# EAGLE design HallSenseV2 (EAGLE 8.6.0)
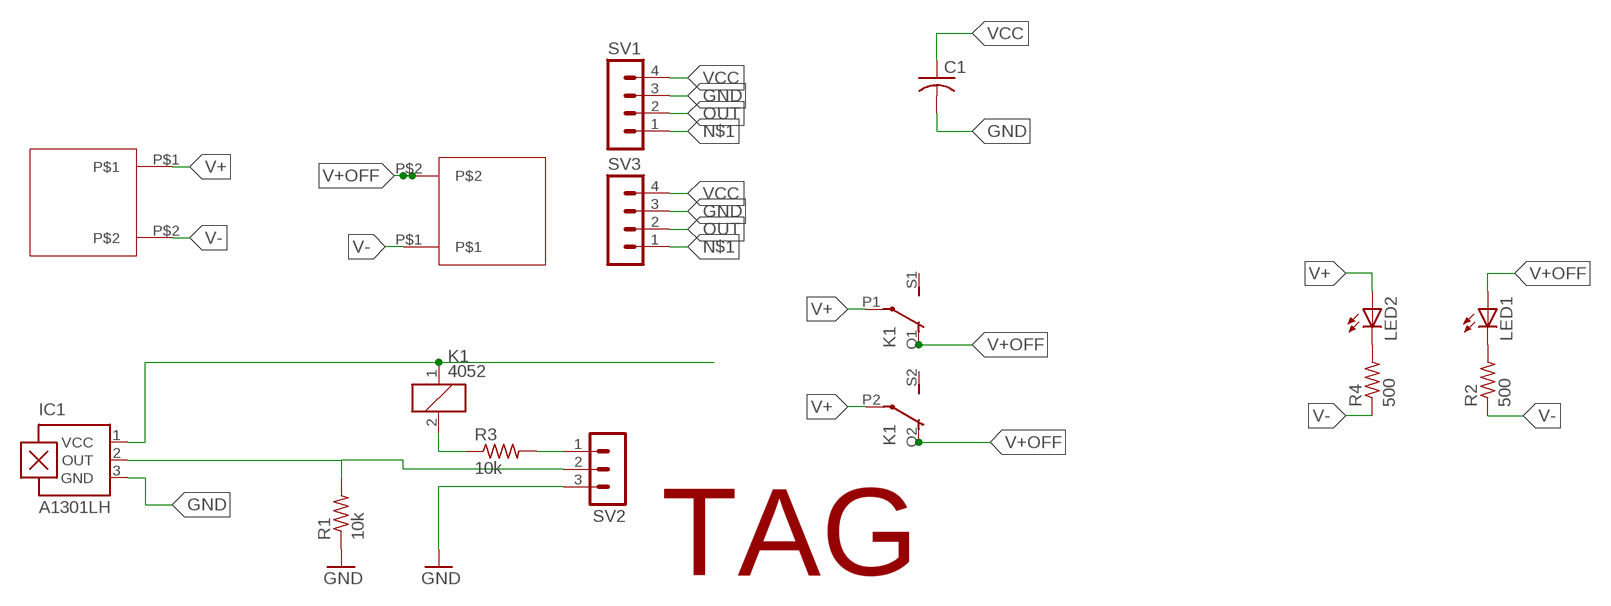
[diagram p0: schematic, sheet 1]

## Parts
C1  C-USC0805K  [C0805K]
IC1  A1301LH  [SOT23-W]
K1  4052  [F4052]
LED1  LED5MM  [LED5MM]
LED2  LED5MM  [LED5MM]
R1  10k  R-US_R0805  [R0805]
R2  500  R-US_0207/10  [0207/10]
R3  10k  R-US_R0805  [R0805]
R4  500  R-US_0207/10  [0207/10]
SV1  MA04-1  [MA04-1]
SV2  MA03-1  [MA03-1]
SV3  MA04-1  [MA04-1]
U$1  TERM_POWER  [TERM_BLOCK_POWER]
U$2  TERM_POWER  [TERM_BLOCK_POWER]
U$3  TAG  [TAG]

## Nets
GND: C1.2 IC1.3(GND) R1.1 SV1.3 SV2.3 SV3.3
N$1: K1.2 R3.1 SV1.1 SV3.1
N$2: LED2.K(C) R4.2
N$3: LED1.K(C) R2.2
N$4: R3.2 SV2.1
OUT: IC1.2(OUT) R1.2 SV1.2 SV2.2 SV3.2
V+: K1.P1(2:P) K1.P2(3:P) LED2.A U$1.P$1
V+OFF: K1.O1(2:O) K1.O2(3:O) LED1.A U$2.P$2
V-: R2.1 R4.1 U$1.P$2 U$2.P$1
VCC: C1.1 IC1.1(VCC) K1.1 SV1.4 SV3.4
Unconnected: K1.S1(2:S) K1.S2(3:S)

## Library data of the parts
C1 = rcl:C-US: CAPACITOR, American symbol; SPICEPREFIX: C
IC1 = allegro:A13*?: Linear Hall Effect Sensor ICs Continuous-Time Ratiometric High-Temperature Operation Programmable Linear with Analog Output A1302 -Replacement- UGN3503 Source: http://www.allegromicro.com/en/Products/Part_Numbers/1301/1301.pdf http://www.allegromicro.com/en/Products/Part_Numbers/1321/1321.pdf http://www.allegromicro.com/en/Products/Part_Numbers/1381/1381.pdf; MF: ALLEGRO MICROSYSTEMS, INC.; MPN: A1301ELHLT-T; OC_FARNELL: 1198084; OC_NEWARK: 31K6634
K1 = relay:4052: RELAY 2 x switch, Finder; OC_FARNELL: unknown; OC_NEWARK: unknown; SPICEPREFIX: J
LED1 LED2 = led:LED: LED OSRAM: - CHIPLED LG R971, LG N971, LY N971, LG Q971, LY Q971, LO R971, LY R971 LH N974, LH R974 LS Q976, LO Q976, LY Q976 LO Q996 - Hyper CHIPLED LW Q18S LB Q993, LB Q99A, LB R99A - SideLED LS A670, LO A670, LY A670, LG A670, LP A670 LB A673, LV A673, LT A673, LW A673 LH A674 LY A675 LS A676, LA A676, LO A676, LY A676, LW A676 LS A679, LY A679, LG A679 - Hyper Micro SIDELED® LS Y876, LA Y876, LO Y876, LY Y876 LT Y87S - SmartLED LW L88C, LW L88S LB L89C, LB L89S, LG L890 LS L89K, LO L89K, LY L89K LS L896, LA L896, LO L896, LY L896 - TOPLED LS T670, LO T670, LY T670, LG T670, LP T670 LSG T670, LSP T670, LSY T670, LOP T670, LYG T670 LG T671, LOG T671, LSG T671 LB T673, LV T673, LT T673, LW T673 LH T674 LS T676, LA T676, LO T676, LY T676, LB T676, LH T676, LSB T676, LW T676 LB T67C, LV T67C, LT T67C, LS T67K, LO T67K, LY T67K, LW E67C LS E67B, LA E67B, LO E67B, LY E67B, LB E67C, LV E67C, LT E67C LW T67C LS T679, LY T679, LG T679 LS T770, LO T770, LY T770, LG T770, LP T770 LB T773, LV T773, LT T773, LW T773 LH T774 LS E675, LA E675, LY E675, LS T675 LS T776, LA T776, LO T776, LY T776, LB T776 LHGB T686 LT T68C, LB T68C - Hyper Mini TOPLED® LB M676 - Mini TOPLED Santana® LG M470 LS M47K, LO M47K, LY M47K Source: http://www.osram.convergy.de LUXEON: - LUMILED® LXK2-PW12-R00, LXK2-PW12-S00, LXK2-PW14-U00, LXK2-PW14-V00 LXK2-PM12-R00, LXK2-PM12-S00, LXK2-PM14-U00 LXK2-PE12-Q00, LXK2-PE12-R00, LXK2-PE12-S00, LXK2-PE14-T00, LXK2-PE14-U00 LXK2-PB12-K00, LXK2-PB12-L00, LXK2-PB12-M00, LXK2-PB14-N00, LXK2-PB14-P00, LXK2-PB14-Q00 LXK2-PR12-L00, LXK2-PR12-M00, LXK2-PR14-Q00, LXK2-PR14-R00 LXK2-PD12-Q00, LXK2-PD12-R00, LXK2-PD12-S00 LXK2-PH12-R00, LXK2-PH12-S00 LXK2-PL12-P00, LXK2-PL12-Q00, LXK2-PL12-R00 Source: www.luxeon.com KINGBRIGHT: KA-3528ASYC Source: www.kingbright.com
R1 R3 = resistor:R-US_: RESISTOR, American symbol
R2 R4 = rcl:R-US_: RESISTOR, American symbol; SPICEPREFIX: R
SV1 SV3 = con-lstb:MA04-1: PIN HEADER; OC_FARNELL: unknown; OC_NEWARK: unknown
SV2 = con-lstb:MA03-1: PIN HEADER; OC_FARNELL: unknown; OC_NEWARK: unknown
U$1 U$2 = TERM_POWER:TERM_POWER
U$3 = TAG:TAG

## Board
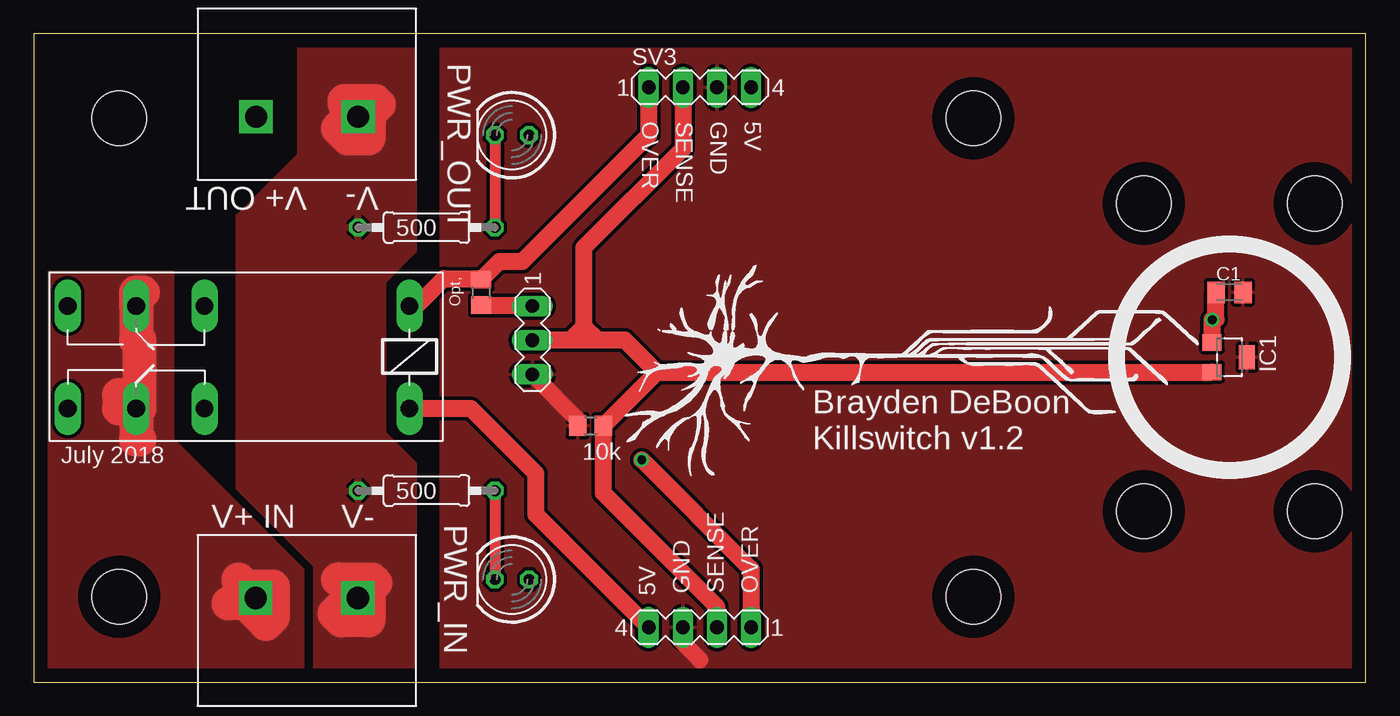
[diagram p1: board, top side]
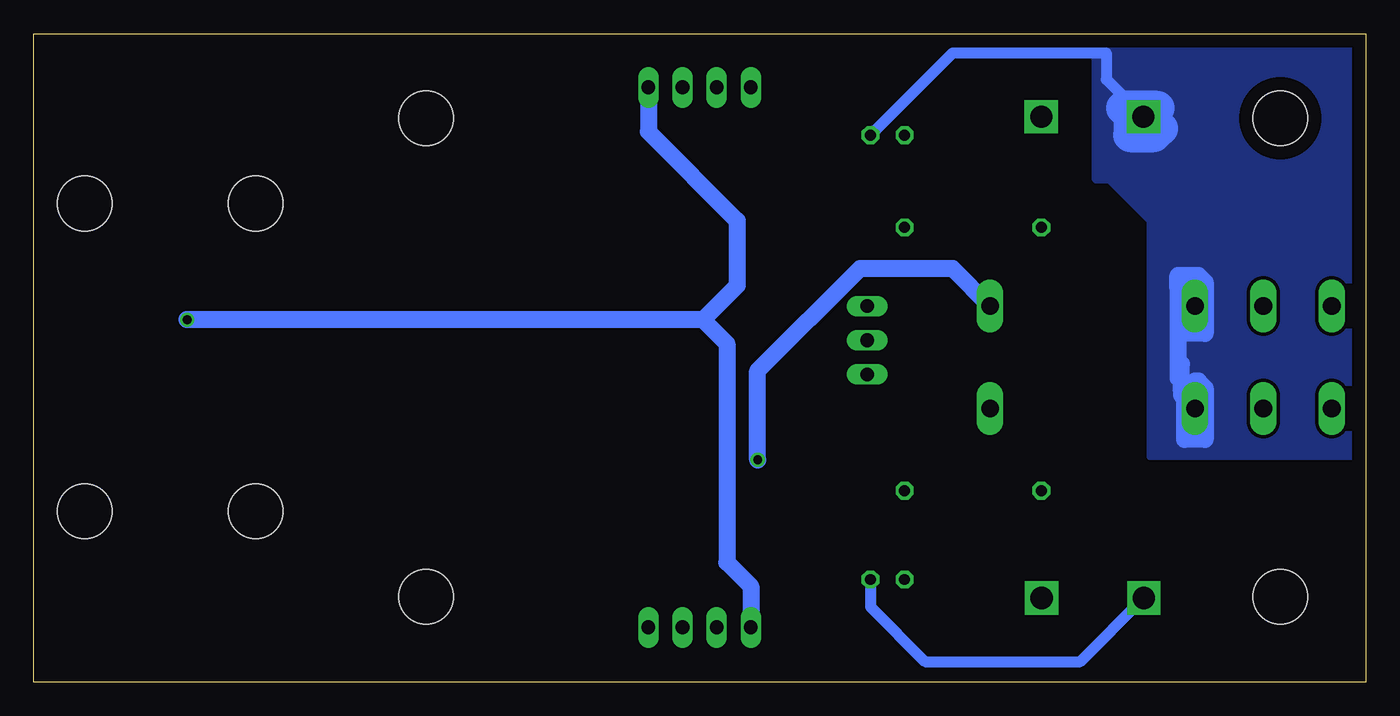
[diagram p2: board, bottom side, seen from below]

Size 99.04 x 48.18 mm. Coordinates in mm from the lower left corner, seen from the top.
Outline: 0,0 99.04,0 99.04,48.18 0,48.18 0,0
Copper layers (1*16): Top 0.035mm / dielectric 1.5mm / Bottom 0.035mm
Design rules "default *": minimum track width 6mil, minimum drill 0.35mm, track to track 10mil, track to pad 10mil, pad to pad 10mil, via to via 10mil, smd to smd 6mil, copper to edge 40mil, drill to drill 6mil, minimum pad ring 10mil, minimum via ring 8mil, stop-mask expansion 4mil, vias tented up to drill 0mil, thermal gap 10mil
Holes 4.06 mm at 6.35,41.91 6.35,6.35 95.25,35.56 82.55,35.56 82.55,12.7 95.25,12.7 69.85,41.91 69.85,6.35

### Footprints (pad centres in the part's own frame; a part is rotated, then mirrored left to right if it is on the bottom)
C0805K = smd 1.3 x 1.6: 1 -1,0; 2 1,0
SOT23-W = smd 1.2 x 1.4: 1 -1.1,-1.3; 2 1.1,-1.3 | smd 1.8 x 1.2: 3 0,1.3
F4052 = drill 1.321 long: 1 -3.81,3.81; 2 -3.81,-3.81; O1 11.43,-3.81; O2 11.43,3.81; P1 16.51,-3.81; P2 16.51,3.81; S1 21.59,-3.81; S2 21.59,3.81
LED5MM = drill 0.813 octagon: A -1.27,0; K 1.27,0
R0805 = smd 1.3 x 1.5: 1 -0.95,0; 2 0.95,0
0207/10 = drill 0.813 octagon: 1 -5.08,0; 2 5.08,0
MA04-1 = drill 1.016 long: 1 -3.81,0; 2 -1.27,0; 3 1.27,0; 4 3.81,0
MA03-1 = drill 1.016 long: 1 -2.54,0; 2 0,0; 3 2.54,0
TERM_BLOCK_POWER = drill 1.651 square: P$1 -3.81,1.676; P$2 3.785,1.676

### Placement (x,y rotation side)
C1  88.9,28.96 0 top
IC1  88.9,24.13 270 top
K1  24.13,24.13 180 top
LED1  35.56,40.64 180 top
LED2  35.56,7.62 180 top
R1  41.4,19.05 0 top
R2  29.21,33.78 0 top
R3  33.27,28.96 270 top
R4  29.21,14.22 0 top
SV1  49.53,4.06 180 top
SV2  37.08,25.4 270 top
SV3  49.53,44.2 0 top
U$1  20.32,4.57 0 top
U$2  20.32,43.69 180 top
U$3  86.61,30.99 180 top

### Tracks (layer width: path | path; a pad name or v marks a point on that pad's centre or on a via)
GND
  Top 1.27: SV2.3 40.45,19.49 R1.1 | SV1.3 48.26,2.92 49.53,1.65
  pour Top: 30.23,48.51 30.23,-0.25 99.06,-0.25 99.06,48.51
N$1  (via drill 0.65)
  Top 1.27: v45.21,16.51 53.34,8.38 SV1.1 | K1.2 28.45,27.94 30.48,29.97 33.21,29.97 R3.1 34.61,31.24 36.32,31.24 45.72,40.64 SV3.1
  Bottom 1.27: v45.21,16.51 45.21,23.11 37.59,30.73 30.73,30.73 K1.2
N$2
  Top 0.813: R4.2 LED2.K
N$3
  Top 0.813: LED1.K R2.2
N$4
  Top 1.27: R3.2 37.02,28.01 SV2.1
OUT
  Top 1.27: SV1.2 50.8,5.59 42.35,14.04 R1.2 46.33,23.03 | 46.33,23.03 43.96,25.4 41.91,25.4 | 41.91,25.4 40.89,25.4 | 40.89,25.4 39.88,25.4 | 39.88,25.4 SV2.2 | SV3.2 48.26,39.62 40.89,32.26 40.89,26.42 | 40.89,26.42 40.89,25.4 | 39.88,25.4 40.89,26.42 | 40.89,26.42 41.91,25.4 | 46.33,23.03 IC1.2
V+
  Top 2.54: 8.13,28.96 7.62,28.96 K1.P1 7.62,25.4 7.87,25.4 7.87,20.32 K1.P2 | K1.P2 6.35,20.32 6.35,21.34 | K1.P2 7.62,18.03 7.87,18.03 | 15.75,5.84 17.27,4.32 17.78,4.83 17.78,7.11 15.75,7.11 15.24,7.62 15.24,7.52 U$1.P$1 16.1,5.84 15.75,5.84 | 15.75,5.84 14.48,5.84
  Bottom 0.813: LED2.A 36.83,5.59 32.77,1.52 21.23,1.52 U$1.P$1
  pour Top: 20.07,-0.25 20.07,8.38 10.41,18.03 10.41,30.48 5.33,30.48 5.33,-0.25
  pour Top: 5.33,30.48 0,30.48 0,0 0,-0.25 10.41,-0.25 10.41,30.48
V+OFF
  Bottom 0.813: LED1.A 30.71,46.76 19.3,46.76 19.3,44.78 U$2.P$2
  Bottom 1.27: K1.O1 13.97,29.21 | 13.97,29.21 13.97,30.23 12.45,30.23 11.94,29.72 11.94,25.91 13.97,25.91 13.46,26.42 13.46,29.72 | 13.46,29.72 13.21,29.97 | 13.46,29.72 13.97,29.21 | 13.72,21.59 13.46,21.34 13.46,18.03 11.94,18.03 11.94,21.84 12.45,22.35 12.7,22.35 13.21,21.84 13.97,22.61 13.97,29.21 | 13.72,21.59 13.72,23.62 | 13.72,21.59 13.72,21.34 K1.O2
  Bottom 2.54: U$2.P$2 16.15,42.01 15.49,42.67 18.03,42.67 17.53,42.16 17.53,40.64 15.75,40.64 15.24,41.15 16.1,42.01 U$2.P$2
  pour Bottom (rank 3): 20.07,37.34 20.07,48.51 -0.25,48.51 -0.25,16.76 16,16.76 16,34.29 19.05,37.34
V-
  Top 2.54: 22.73,7.62 U$1.P$2 23.52,6.25 22.35,5.08 22.86,4.57 24.89,4.57 24.89,6.86 25.4,7.37 25.15,7.62 22.73,7.62 | 22.73,7.62 22.61,7.62 | U$2.P$1 23.11,43.03 23.11,43.18 25.4,43.18 25.65,42.93 24.89,42.16 24.89,40.39 23.37,40.39 22.61,41.15 23.47,42.01 U$2.P$1
  pour Top: 20.83,48.26 20.83,-0.25 28.45,-0.25 28.45,16.26 26.16,18.54 26.16,29.72 28.45,32 28.45,48.26
  pour Top: 25.65,-0.25 25.65,48.26 19.81,48.26 19.81,39.12 15.24,34.54 15.24,14.48 21.08,8.64 21.08,-0.25
VCC  (via drill 0.65)
  Top 1.27: SV1.4 37.34,12.45 37.34,15.49 32.51,20.32 K1.1 | C1.1 87.9,26.92 v87.63,26.92 87.6,26.92 IC1.1
  Bottom 1.27: 49.28,26.92 47.5,25.15 47.5,8.89 45.72,7.11 SV1.4 | SV3.4 53.34,40.89 46.74,34.29 46.74,29.46 49.28,26.92 | 49.28,26.92 v87.63,26.92

### Text on the board
tPlace: PWR_OUT | OVER | SENSE | GND | 5V | V+ OUT | V- | Opt, | Brayden DeBoon / Killswitch v1.2 | July 2018 | PWR_IN | V+ IN | V- | 5V | GND | SENSE | OVER